# EAGLE design dual-basler-shield (EAGLE 8.7.0)
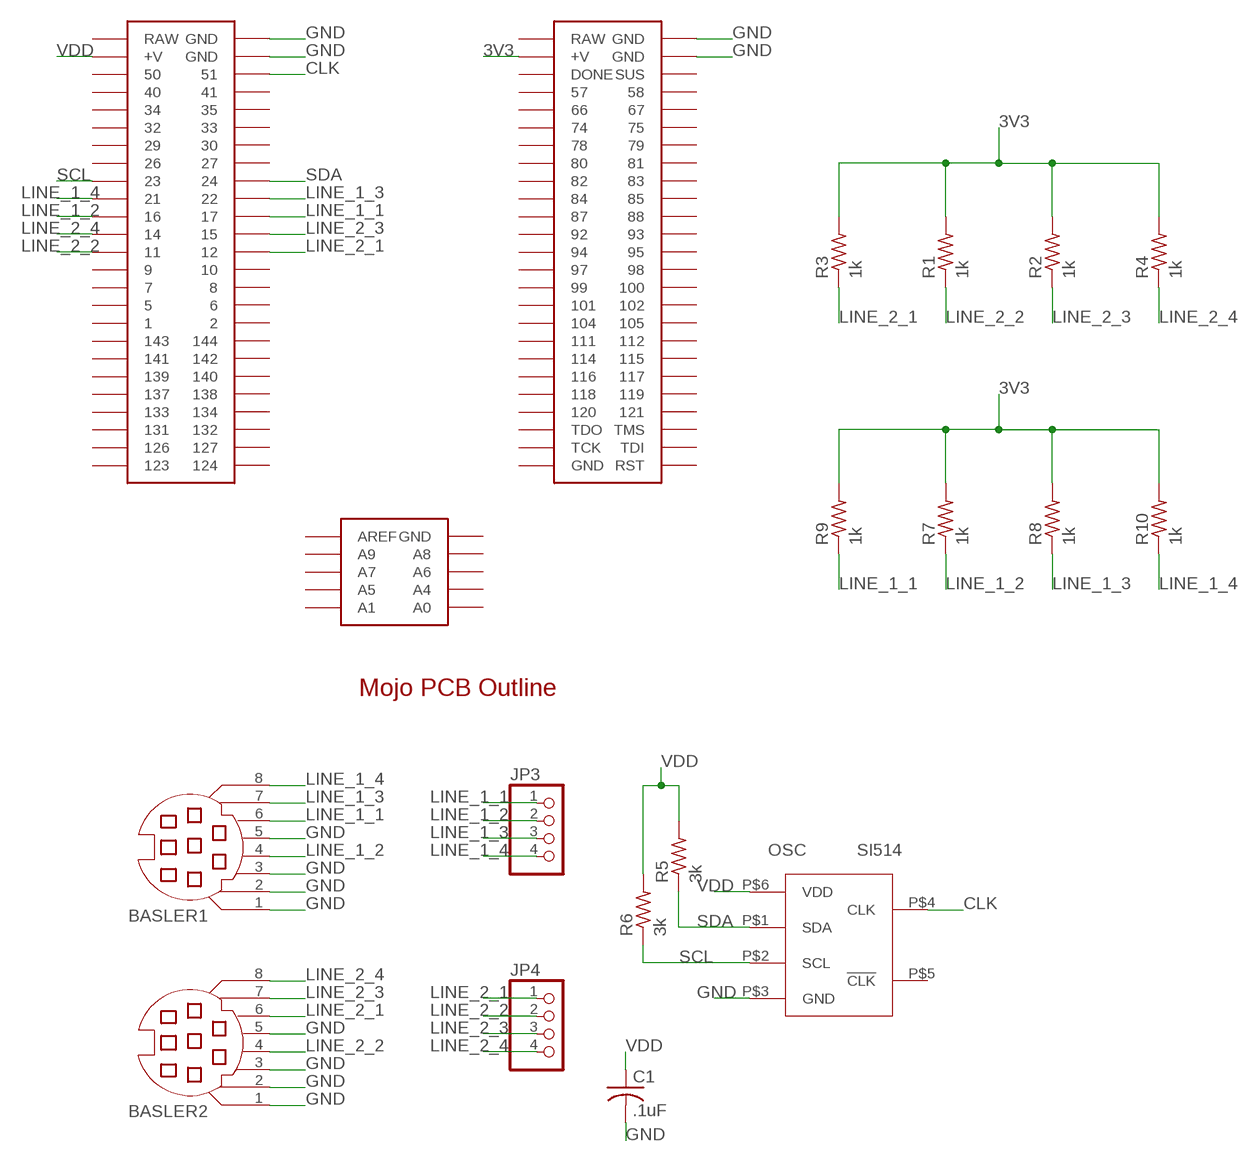
[diagram p0: schematic, sheet 1]

## Parts
BASLER1  MD08SS  [MDIN08SS]
BASLER2  MD08SS  [MDIN08SS]
C1  .1uF  C-USC0603  [C0603]
JP3  PINHD-1X4  [1X04]
JP4  PINHD-1X4  [1X04]
OSC  SI514  [XTAL-6PIN]
R1  1k  R-US_R0603  [R0603]
R2  1k  R-US_R0603  [R0603]
R3  1k  R-US_R0603  [R0603]
R4  1k  R-US_R0603  [R0603]
R5  3k  R-US_R0603  [R0603]
R6  3k  R-US_R0603  [R0603]
R7  1k  R-US_R0603  [R0603]
R8  1k  R-US_R0603  [R0603]
R9  1k  R-US_R0603  [R0603]
R10  1k  R-US_R0603  [R0603]
U$3  MOJO_OUTLINE  [MOJO_OUTLINE]
U$4  MOJOV3  [MOJO_V3]

## Nets
3V3: R1.2 R2.2 R3.2 R4.2 R7.2 R8.2 R9.2 R10.2 U$4.V@2(+V)
CLK: OSC.P$4(CLK) U$4.51
GND: BASLER1.1 BASLER1.2 BASLER1.3 BASLER1.5 BASLER2.1 BASLER2.2 BASLER2.3 BASLER2.5 C1.2 OSC.P$3(GND) U$4.GND@1(GND) U$4.GND@2(GND) U$4.GND@3(GND) U$4.GND@4(GND)
LINE_1_1: BASLER1.6 JP3.1 R9.1 U$4.17
LINE_1_2: BASLER1.4 JP3.2 R7.1 U$4.16
LINE_1_3: BASLER1.7 JP3.3 R8.1 U$4.22
LINE_1_4: BASLER1.8 JP3.4 R10.1 U$4.21
LINE_2_1: BASLER2.6 JP4.1 R3.1 U$4.12
LINE_2_2: BASLER2.4 JP4.2 R1.1 U$4.11
LINE_2_3: BASLER2.7 JP4.3 R2.1 U$4.15
LINE_2_4: BASLER2.8 JP4.4 R4.1 U$4.14
SCL: OSC.P$2(SCL) R6.1 U$4.23
SDA: OSC.P$1(SDA) R5.1 U$4.24
VDD: C1.1 OSC.P$6(VDD) R5.2 R6.2 U$4.V@1(+V)
Unconnected: OSC.P$5(!CLK) U$4.1 U$4.2 U$4.5 U$4.6 U$4.7 U$4.8 U$4.9 U$4.10 U$4.26 U$4.27 U$4.29 U$4.30 U$4.32 U$4.33 U$4.34 U$4.35 U$4.40 U$4.41 U$4.50 U$4.57 U$4.58 U$4.66 U$4.67 U$4.74 U$4.75 U$4.78 U$4.79 U$4.80 U$4.81 U$4.82 U$4.83 U$4.84 U$4.85 U$4.87 U$4.88 U$4.92 U$4.93 U$4.94 U$4.95 U$4.97 U$4.98 U$4.99 U$4.100 U$4.101 U$4.102 U$4.104 U$4.105 U$4.111 U$4.112 U$4.114 U$4.115 U$4.116 U$4.117 U$4.118 U$4.119 U$4.120 U$4.121 U$4.123 U$4.124 U$4.126 U$4.127 U$4.131 U$4.132 U$4.133 U$4.134 U$4.137 U$4.138 U$4.139 U$4.140 U$4.141 U$4.142 U$4.143 U$4.144 U$4.A0 U$4.A1 U$4.A4 U$4.A5 U$4.A6 U$4.A7 U$4.A8 U$4.A9 U$4.AREF U$4.DONE U$4.GND@5(GND) U$4.GND@6(GND) U$4.RAW@1(RAW) U$4.RAW@2(RAW) U$4.RST U$4.SUS U$4.TCK U$4.TDI U$4.TDO U$4.TMS

## Library data of the parts
BASLER1 BASLER2 = con-yamaichi:MD08SS: YAMAICHI CONNECTOR; OC_FARNELL: unknown; OC_NEWARK: unknown
C1 = rcl:C-US: CAPACITOR, American symbol; SPICEPREFIX: C
JP3 JP4 = pinhead:PINHD-1X4: PIN HEADER
OSC = lupa300-components:SI514
R1-R10 = rcl:R-US_: RESISTOR, American symbol; SPICEPREFIX: R
U$3 = EmbeddedMicro-Mojo:MOJO_OUTLINE
U$4 = EmbeddedMicro-Mojo:MOJO

## Board
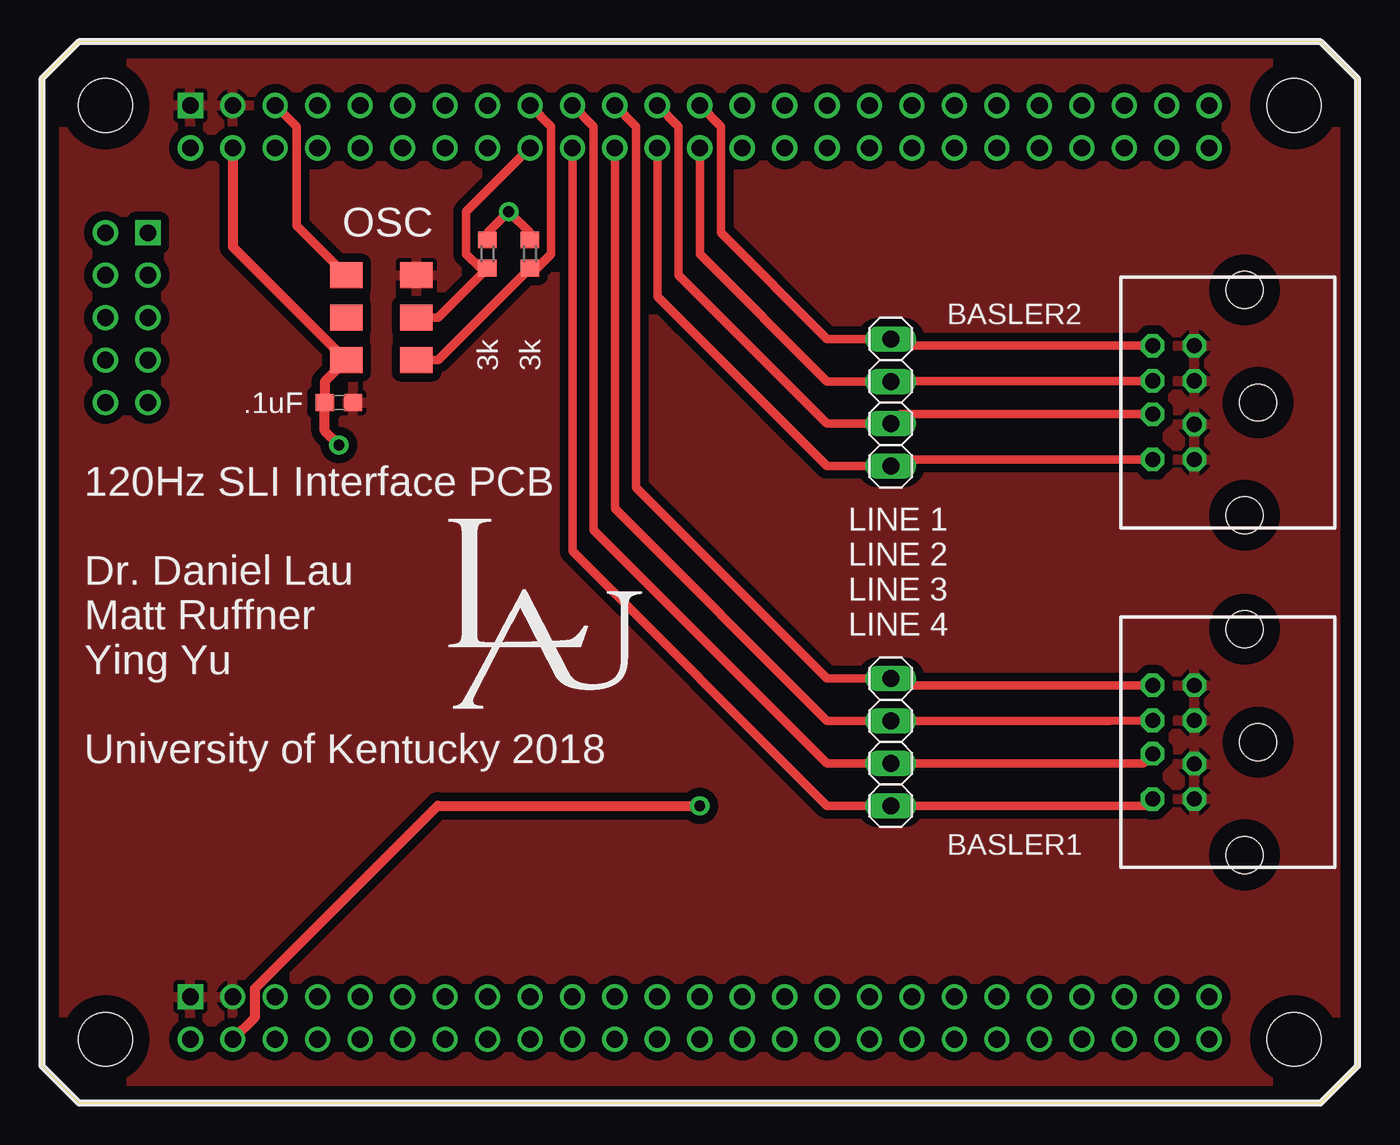
[diagram p1: board, top side]
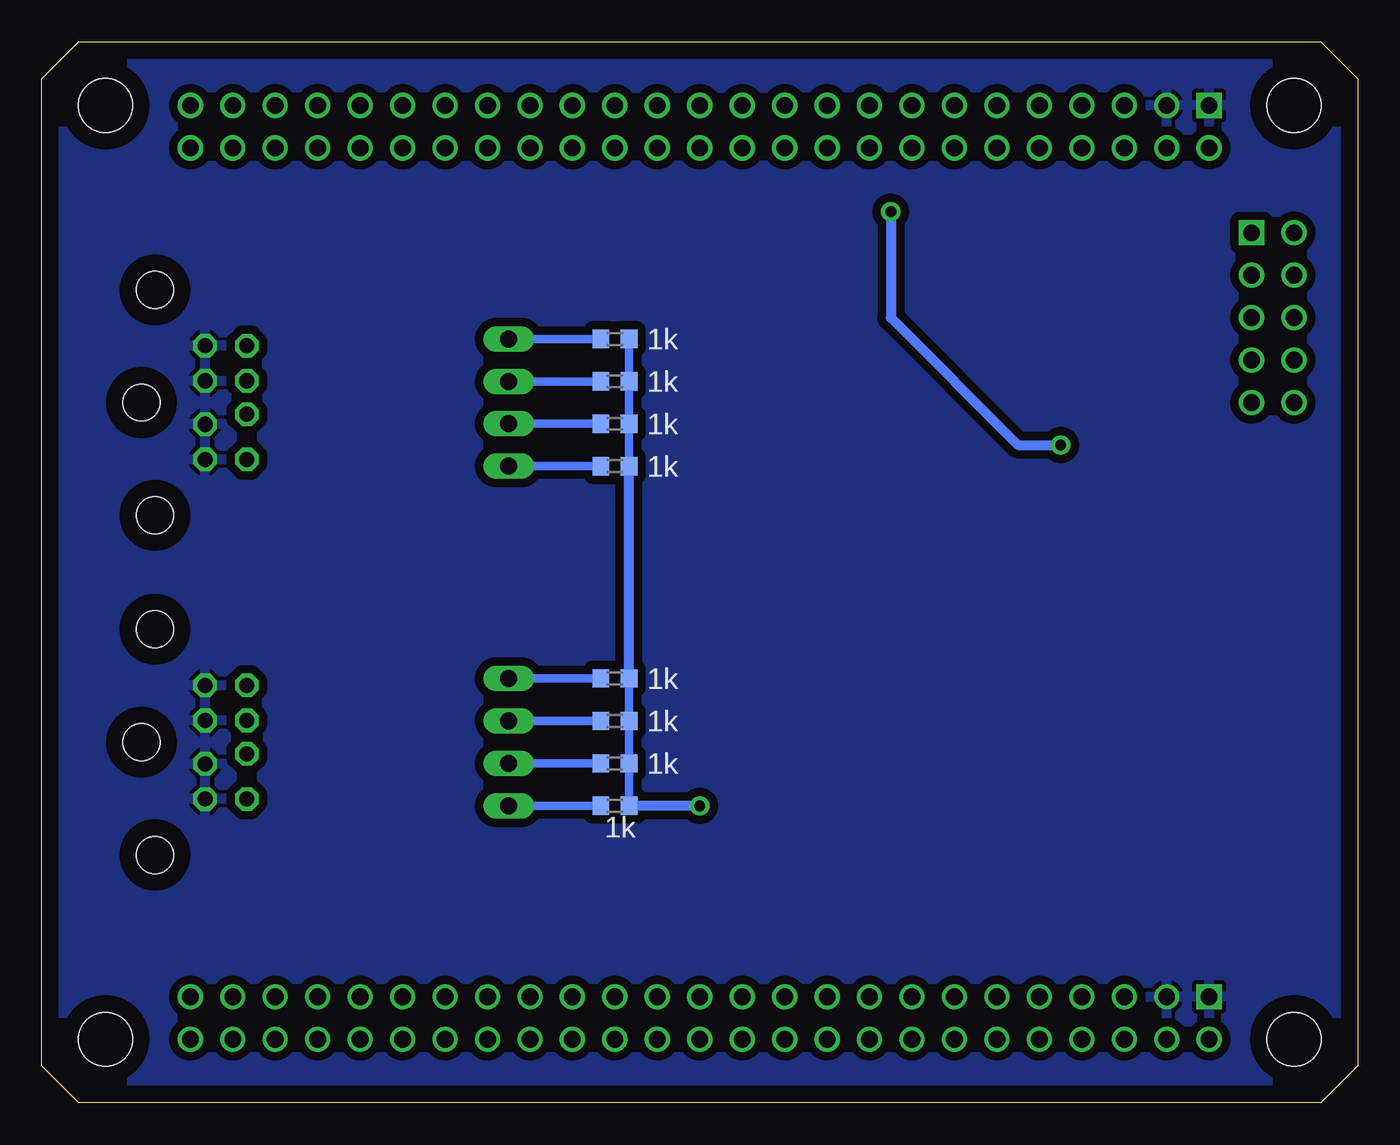
[diagram p2: board, bottom side, seen from below]

Size 78.74 x 63.5 mm. Coordinates in mm from the lower left corner, seen from the top.
Copper layers (1*16): Top 0.035mm / dielectric 1.5mm / Bottom 0.035mm
Design rules "default": minimum track width 6mil, minimum drill 0.35mm, track to track 6mil, track to pad 6mil, pad to pad 6mil, via to via 6mil, smd to smd 6mil, copper to edge 40mil, drill to drill 6mil, minimum pad ring 10mil, minimum via ring 8mil, stop-mask expansion 4mil, vias tented up to drill 0mil, thermal gap 10mil

### Footprints (pad centres in the part's own frame; a part is rotated, then mirrored left to right if it is on the bottom)
MDIN08SS = drill 0.9 octagon: 1 1.3,8.5; 2 -1.3,8.5; 3 3.4,8.5; 4 1.3,11; 5 -3.4,8.5; 6 3.4,11; 7 -0.7,11; 8 -3.4,11 | hole 2.2: -6.75,5.5; 0,4.7; 6.75,5.5
C0603 = smd 1.1 x 1: 1 -0.85,0; 2 0.85,0
1X04 = drill 1.016 long: 1 -3.81,0; 2 -1.27,0; 3 1.27,0; 4 3.81,0
XTAL-6PIN = smd 1.95 x 1.55: P$1 -2.1,2.54; P$2 -2.1,0; P$3 -2.1,-2.54; P$4 2.1,-2.54; P$5 2.1,0; P$6 2.1,2.54
R0603 = smd 1 x 1.1: 1 -0.85,0; 2 0.85,0
MOJO_V3 = drill 1: 1 49.53,57.15; 2 49.53,59.69; 5 46.99,57.15; 6 46.99,59.69; 7 44.45,57.15; 8 44.45,59.69; 9 41.91,57.15; 10 41.91,59.69; 11 39.37,57.15; 12 39.37,59.69; 14 36.83,57.15; 15 36.83,59.69; 16 34.29,57.15; 17 34.29,59.69; 21 31.75,57.15; 22 31.75,59.69; 23 29.21,57.15; 24 29.21,59.69; 26 26.67,57.15; 27 26.67,59.69; 29 24.13,57.15; 30 24.13,59.69; 32 21.59,57.15; 33 21.59,59.69; 34 19.05,57.15; 35 19.05,59.69; 40 16.51,57.15; 41 16.51,59.69; 50 13.97,57.15; 51 13.97,59.69; 57 16.51,3.81; 58 16.51,6.35; 66 19.05,3.81; 67 19.05,6.35; 74 21.59,3.81; 75 21.59,6.35; 78 24.13,3.81; 79 24.13,6.35; 80 26.67,3.81; 81 26.67,6.35; 82 29.21,3.81; 83 29.21,6.35; 84 31.75,3.81; 85 31.75,6.35; 87 34.29,3.81; 88 34.29,6.35; 92 36.83,3.81; 93 36.83,6.35; 94 39.37,3.81; 95 39.37,6.35; 97 41.91,3.81; 98 41.91,6.35; 99 44.45,3.81; 100 44.45,6.35; 101 46.99,3.81; 102 46.99,6.35; 104 49.53,3.81; 105 49.53,6.35; 111 52.07,3.81; 112 52.07,6.35; 114 54.61,3.81; 115 54.61,6.35; 116 57.15,3.81; 117 57.15,6.35; 118 59.69,3.81; 119 59.69,6.35; 120 62.23,3.81; 121 62.23,6.35; 123 69.85,57.15; 124 69.85,59.69; 126 67.31,57.15; 127 67.31,59.69; 131 64.77,57.15; 132 64.77,59.69; 133 62.23,57.15; 134 62.23,59.69; 137 59.69,57.15; 138 59.69,59.69; 139 57.15,57.15; 140 57.15,59.69; 141 54.61,57.15; 142 54.61,59.69; 143 52.07,57.15; 144 52.07,59.69; A0 6.35,41.91; A1 3.81,41.91; A4 6.35,44.45; A5 3.81,44.45; A6 6.35,46.99; A7 3.81,46.99; A8 6.35,49.53; A9 3.81,49.53; AREF 3.81,52.07; DONE 13.97,3.81; GND@2 11.43,59.69; GND@4 11.43,6.35; GND@6 69.85,3.81; RAW@1 8.89,57.15; RAW@2 8.89,3.81; RST 69.85,6.35; SUS 13.97,6.35; TCK 67.31,3.81; TDI 67.31,6.35; TDO 64.77,3.81; TMS 64.77,6.35; V@1 11.43,57.15; V@2 11.43,3.81 | drill 1 square: GND@1 8.89,59.69; GND@3 8.89,6.35; GND@5 6.35,52.07 | hole 3.2: 3.81,3.81; 3.81,59.69; 74.93,59.69; 74.93,3.81

### Placement (x,y rotation side)
BASLER1  77.47,21.59 90 top
BASLER2  77.47,41.91 90 top
C1  17.78,41.91 0 top
JP3  50.8,21.59 270 top
JP4  50.8,41.91 270 top
OSC  20.32,46.99 180 top
R1  44.45,43.18 0 bottom
R2  44.45,40.64 0 bottom
R3  44.45,45.72 0 bottom
R4  44.45,38.1 0 bottom
R5  29.21,50.8 90 top
R6  26.67,50.8 90 top
R7  44.45,22.86 0 bottom
R8  44.45,20.32 0 bottom
R9  44.45,25.4 0 bottom
R10  44.45,17.78 0 bottom
U$3  0,0 0 top
U$4  0,0 0 top

### Tracks (layer width: path | path; a pad name or v marks a point on that pad's centre or on a via)
3V3  (via drill 0.65 pad 1.15)
  Top 0.61: U$4.V@2 12.76,5.14 12.76,6.85 23.69,17.78 v39.37,17.78
  Bottom 0.508: R3.2 R1.2 R2.2 R4.2 | R9.2 R7.2 R8.2 R10.2
  Bottom 0.61: v39.37,17.78 R10.2 | R9.2 R4.2
CLK
  Top 0.508: U$4.51 15.24,58.42 15.24,52.51 OSC.P$4
GND
  pour Top (isolate 0.508): 0,63.5 78.74,63.5 78.74,0 0,0
  pour Bottom (isolate 0.508): 0,63.5 78.74,63.5 78.74,0 0,0
LINE_1_1
  Top 0.508: BASLER1.6 51.21,24.99 JP3.1 46.99,25.4 35.56,36.83 35.56,58.42 U$4.17
  Bottom 0.508: JP3.1 R9.1
LINE_1_2
  Top 0.508: BASLER1.4 63.9,22.86 JP3.2 46.99,22.86 34.29,35.56 U$4.16
  Bottom 0.508: JP3.2 R7.1
LINE_1_3
  Top 0.508: BASLER1.7 65.9,20.32 JP3.3 46.99,20.32 33.02,34.29 33.02,58.42 U$4.22
  Bottom 0.508: JP3.3 R8.1
LINE_1_4
  Top 0.508: BASLER1.8 66.06,17.78 JP3.4 46.99,17.78 31.75,33.02 U$4.21
  Bottom 0.508: JP3.4 R10.1
LINE_2_1
  Top 0.508: BASLER2.6 51.21,45.31 JP4.1 46.99,45.72 40.64,52.07 40.64,58.42 U$4.12
  Bottom 0.508: JP4.1 R3.1
LINE_2_2
  Top 0.508: BASLER2.4 50.83,43.21 JP4.2 46.99,43.18 39.37,50.8 U$4.11
  Bottom 0.508: JP4.2 R1.1
LINE_2_3
  Top 0.508: BASLER2.7 51.37,41.21 JP4.3 46.99,40.64 38.1,49.53 38.1,58.42 U$4.15
  Bottom 0.508: JP4.3 R2.1
LINE_2_4
  Top 0.508: BASLER2.8 51.21,38.51 JP4.4 46.99,38.1 36.83,48.26 U$4.14
  Bottom 0.508: JP4.4 R4.1
SCL
  Top 0.508: OSC.P$2 23.71,46.99 R6.1 26.25,49.95 25.4,50.8 25.4,53.34 U$4.23
SDA
  Top 0.508: OSC.P$1 23.71,44.45 R5.1 29.63,49.95 30.48,50.8 30.48,58.42 U$4.24
VDD  (via drill 0.65 pad 1.15)
  Top 0.508: R5.2 29.21,52.07 v27.94,53.34 26.67,52.07 R6.2
  Top 0.61: U$4.V@1 11.43,51.24 OSC.P$6 16.93,43.16 C1.1 16.93,40.22 v17.78,39.37
  Bottom 0.61: v27.94,53.34 27.94,46.99 20.32,39.37 v17.78,39.37

### Text on the board
tNames: LINE 1 / LINE 2 / LINE 3 / LINE 4 | 120Hz SLI Interface PCB / / Dr. Daniel Lau / Matt Ruffner / Ying Yu / / University of Kentucky 2018